# Altium schematic sheet Switch.SchDoc
size A4; DocumentNumber: 9; SheetNumber: 9; SheetTotal: 10
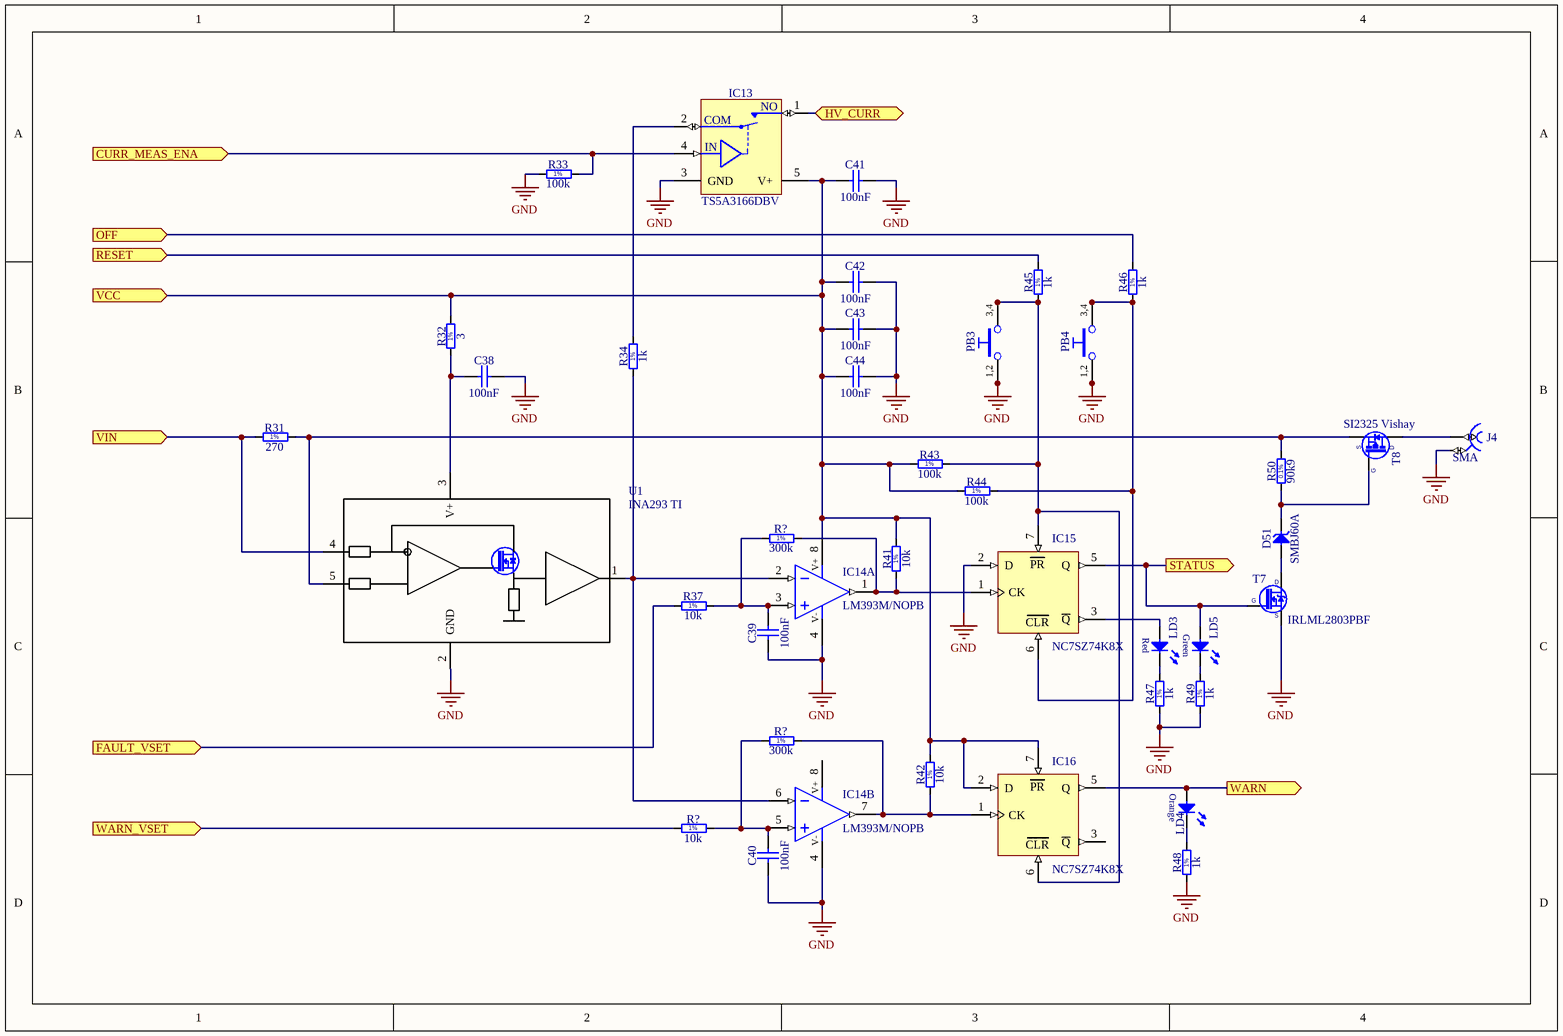
[diagram p0: Switch.SchDoc]

## Parts
(Parts that share a designator on the sheet are numbered #1, #2 ... from top to bottom, then left to right.)
C38  100nF  [CAPC2012X135N]
C39  100nF  [CAPC2012X135N]
C40  100nF  [CAPC2012X135N]
C41  100nF  [CAPC2012X135N]
C42  100nF  [CAPC2012X135N]
C43  100nF  [CAPC2012X135N]
C44  100nF  [CAPC2012X135N]
D51  SMBJ60A  [DIOM5336X265N]
IC13  TS5A3166DBV  [SOT95P280X145-5N]
IC14  LM393M/NOPB  [SOIC127P600X175-8N]  (parts A,B of 2)
IC15  NC7SZ74K8X  [SOP50P310X90-8N]
IC16  NC7SZ74K8X  [SOP50P310X90-8N]
J4  SMA  [AMPHENOL_132134]
LD3  Super Red  [LED_OSRAM_LSR976]  (value not drawn)
LD4  Orange  [LED_OSRAM_LOR976]  (value not drawn)
LD5  Green  [LED_OSRAM_LGR971]  (value not drawn)
PB3  Push Button  [PB_OMRON_B3F-1000]  (value not drawn)
PB4  Push Button  [PB_OMRON_B3F-1000]  (value not drawn)
R31  270  [RESC2012X60N]
R32  3  [RESC2012X60N]
R33  100k  [RESC2012X60N]
R34  1k  [RESC2012X60N]
R37  10k  [RESC2012X60N]
R41  10k  [RESC2012X60N]
R42  10k  [RESC2012X60N]
R43  100k  [RESC2012X60N]
R44  100k  [RESC2012X60N]
R45  1k  [RESC2012X60N]
R46  1k  [RESC2012X60N]
R47  1k  [RESC2012X60N]
R48  1k  [RESC2012X60N]
R49  1k  [RESC2012X60N]
R50  90k9  [RESC2012X60N]
R?#1  300k  [RESC2012X60N]
R?#2  300k  [RESC2012X60N]
R?#3  10k  [RESC2012X60N]
T7  IRLML2803PBF  [SOT95P237X112-3N]
T8  SI2325 Vishay  [SOT95P230X112-3N]
U1  INA293 TI  [SOT95P280X110-5N]

## Ports
CURR_MEAS_ENA (in), FAULT_VSET (in), HV_CURR (bidir), OFF (in), RESET (in), STATUS (out), VCC (in), VIN (in), WARN (out), WARN_VSET (in)

## Nets
GND: C38.2 C39.1 C40.1 C41.2 C42.2 C43.2 C44.2 IC13.3(GND) IC14.4(V-) IC15.2(D) J4.2 PB3.1 PB3.2 PB4.1 PB4.2 R33.1 R47.1 R48.1 R49.1 T7.2(S) U1.2(GND)
CURR_MEAS_ENA: IC13.4(IN) R33.2 ; port CURR_MEAS_ENA
FAULT_VSET: R37.1 ; port FAULT_VSET
HV_CURR: IC13.1(NO) ; port HV_CURR
OFF: R46.2 ; port OFF
RESET: R45.2 ; port RESET
STATUS: IC15.5(Q) LD5.2(A) T7.1(G) ; port STATUS
VCC: C41.1 C42.1 C43.1 C44.1 IC13.5(V+) IC14.1(OUT) IC14.8(V+) IC15.1(CK) IC16.2(D) IC16.7(~{PR}) R32.2 R41.1 R41.2 R42.2 R43.1 R44.1 R?#1.2 ; port VCC
VIN: R31.1 U1.4(VIN-) ; port VIN
WARN: IC16.5(Q) LD4.2(A) ; port WARN
WARN_VSET: R?#3.1 ; port WARN_VSET
NetC38_1: C38.1 R32.1 U1.3(V+)
NetC39_2: C39.2 IC14.3(IN+) R37.2 R?#1.1
NetC40_2: C40.2 IC14.5(IN+) R?#2.1 R?#3.2
NetD51_1: D51.1(C) R50.1 T8.1(G)
NetD51_2: D51.2(A) T7.3(D)
NetIC13_2: IC13.2(COM) R34.2
NetIC14_2: IC14.2(IN-) IC14.6(IN-) R34.1 U1.1(OUT)
NetIC14_7: IC14.7(OUT) IC16.1(CK) R42.1 R?#2.2
NetIC15_3: IC15.3(~{Q}) LD3.2(A)
NetIC15_6: IC15.6(~{CLR}) PB4.3 PB4.4 R44.2 R46.1
NetIC15_7: IC15.7(~{PR}) IC16.6(~{CLR}) PB3.3 PB3.4 R43.2 R45.1
NetJ4_1: J4.1 T8.4(D)
NetLD3_1: LD3.1(C) R47.2
NetLD4_1: LD4.1(C) R48.2
NetLD5_1: LD5.1(C) R49.2
NetR31_2: R31.2 R50.2 T8.3(S) U1.5(VIN+)

Not connected (* = marked no-connect by the designer): IC15 4(GND) 8(VCC); IC16 3(~{Q}) 4(GND) 8(VCC)

## Notes on the sheet
- (in symbol LED_OSRAM_LSR976) Red
- (in symbol NC7SZ74K8X) PR; CLR
- (in symbol PB_OMRON_B3F-1000) 3,4; 1,2
- (in symbol R0805_1K_1%_0.33W_100PPM_VISHAY_CRCW-HP) 1%
- (in symbol R0805_3R_1%_0.125W_200PPM) 1%
- (in symbol R0805_10K_1%_0.125W_100PPM) 1%
- (in symbol R0805_90K9_0.1%_0.1W_10PPM) 0.1%
- (in symbol R0805_100K_1%_0.125W_100PPM) 1%
- (in symbol R0805_270R_1%_0.125W_100PPM) 1%
- (in symbol R0805_300K_1%_0.125W_100PPM) 1%

## Library data of the parts
C38-C44 = CC0805_100NF_50V_10%_X7R: Non-polarised capacitor; Part Description: SMD Multilayer Chip Ceramic Capacitor; Manufacturer: GENERIC; Manufacturer1 Part Number: C2012X7R1H104K085AA; Voltage: 50V; TC: X7R; Tolerance: ±10%; Part Number: CC0805_100NF_50V_10%_X7R; Component Kind: Standard; Component Type: Standard; Pin Count: 2; Value: 100nF; Status: Preferred; Manufacturer Part Number: CC0805_100NF_50V_10%_X7R; Case: 0805; Mounted: Yes; Socket: No; SMD: Yes; Sense: No; Manufacturer1 Example: TDK; Manufacturer1 ComponentHeight: 1mm; HelpURL: \\cern.ch\dfs\Applications\Altium\Datasheets\CC0805_X7R_TDK_C.pdf; Author: CERN DEM JLC; CreateDate: 03.12.2007; LatestRevisionDate: 22.04.2015
D51 = SMBJ60A: Zener Diode; Part Description: Uni-Directional Transient Voltage Suppressor Diode; Manufacturer: FAIRCHILD SEMICONDUCTOR; Voltage: 60V; Power: 600W; PressFit: No; Bonding: No; Part Number: SMBJ60A; Component Kind: Standard; Component Type: Standard; Device: SMBJ60A; PackageDescription: DO-214-AA/SMB Diode, Molded Body; 5.34mm L X 3.625mm W X 2.65mm H, IPC Medium Density; Manufacturer Part Number: SMBJ60A; Pin Count: 2; Case: DO-214AA; Mounted: Yes; Socket: No; SMD: Yes; Sense: No; ComponentHeight: 2.65mm; HelpURL: \\cern.ch\dfs\Applications\Altium\Datasheets\SMBJ.pdf; Author: CERN DEM JLC; CreateDate: 30.06.2008; LatestRevisionDate: 19.12.2011
IC13 = TS5A3166DBV: 0.9-Ω SPST Analog Switch; Manufacturer: TEXAS INSTRUMENTS; PressFit: No; Bonding: No; Part Number: TS5A3166DBV; Component Kind: Standard; Component Type: Standard; Device: TS5A3166DBV; PackageDescription: SOT, 0.95mm pitch; 5 pin, 1.60mm W X 2.90mm L X 1.45mm H body, IPC Medium Density; Part Description: 0.9-Ω SPST Analog Switch; Manufacturer Part Number: TS5A3166DBV; Pin Count: 5; Case: SOT23-5; Mounted: Yes; Socket: No; SMD: Yes; Sense: No; ComponentHeight: 1.45mm; Author: CERN DEM MR; HelpURL: \\cern.ch\dfs\Applications\Altium\Datasheets\TS5A3166DBV.pdf; CreateDate: 16.06.2016; LatestRevisionDate: 16.06.2016
IC14 = LM393M/NOPB: Dual Operational Amplifier; Part Description: Low Power Low Offset Voltage Dual Comparators; Manufacturer: NATIONAL SEMICONDUCTOR; PressFit: No; Bonding: No; Part Number: LM393M/NOPB; Component Kind: Standard; Component Type: Standard; Device: LM393M/NOPB; PackageDescription: SOIC 8, Pitch 1.27mm - Body 4x5mm, IPC Medium Density; Manufacturer Part Number: LM393M/NOPB; Pin Count: 8; Case: SOIC8; Mounted: Yes; Socket: No; SMD: Yes; Sense: No; ComponentHeight: 1.75mm; Author: CERN DEM JLC; HelpURL: \\cern.ch\dfs\Applications\Altium\Datasheets\LM393M-NOPB.pdf; CreateDate: 18.11.2011; LatestRevisionDate: 18.11.2011
IC15 IC16 = NC7SZ74K8X: TinyLogic® UHS D-Type Flip-Flop With Preset And Clear; Manufacturer: FAIRCHILD SEMICONDUCTOR; PressFit: No; Bonding: No; Part Number: NC7SZ74K8X; Component Kind: Standard; Component Type: Standard; Device: NC7SZ74K8X; PackageDescription: SOP, 0.50mm pitch; 8 pin, 2.30mm W X 2.00mm L X 0.90mm H body, PC Medium Density; Part Description: TinyLogic® UHS D-Type Flip-Flop With Preset And Clear; Manufacturer Part Number: NC7SZ74K8X; Pin Count: 6; Case: TSSOP8; Mounted: Yes; Socket: No; SMD: Yes; Sense: No; ComponentHeight: 0.9mm; Author: CERN DEM JLC; HelpURL: \\cern.ch\dfs\Applications\Altium\Datasheets\NC7SZ74K8X.pdf; CreateDate: 31.08.2011; LatestRevisionDate: 31.08.2011
J4 = AMPHENOL_132134: Part Description: 50 Ohm Through Hole SMA Straight PCB Jack; Manufacturer Part Number: 132134; PressFit: No; Part Number: AMPHENOL_132134; Component Kind: Standard; Component Type: Standard; Pin Count: 4; Family: SMA; Mounted: Yes; Socket: No; SMD: No; Sense: No; Status: None; Manufacturer: AMPHENOL; ComponentHeight: 9.53mm; HelpURL: \\cern.ch\dfs\Applications\Altium\Datasheets\AMPHENOL_132134.pdf; Author: CERN DEM JLC; CreateDate: 16.12.2013; LatestRevisionDate: 16.12.2013
LD3 = LED_OSRAM_LSR976: LED Red 1C 2A; Part Description: Surface Mount Super Red LED (0805 Case); Manufacturer: OSRAM; Manufacturer Part Number: LSR976; PressFit: No; Bonding: No; Part Number: LED_OSRAM_LSR976; Component Kind: Standard; Component Type: Standard; Color: Super Red; PackageDescription: Super Red Chip LED, 2-Leads, Body 2 x1.25mm, IPC Medium Density; Pin Count: 2; Case: 0805; Mounted: Yes; Socket: No; SMD: Yes; Sense: No; ComponentHeight: 0.9mm; HelpURL: \\cern.ch\dfs\Applications\Altium\Datasheets\LED_OSRAM_LSR976.pdf; Author: CERN DEM JLC; CreateDate: 18.05.2010; LatestRevisionDate: 18.05.2010
LD4 = LED_OSRAM_LOR976: LED Orange 1C 2A; Part Description: Surface Mount Orange LED (0805 Case); Manufacturer: OSRAM; Manufacturer Part Number: LOR976; PressFit: No; Bonding: No; Part Number: LED_OSRAM_LOR976; Component Kind: Standard; Component Type: Standard; Color: Orange; PackageDescription: Orange Chip LED, 2-Leads, Body 2 x1.25mm, IPC Medium Density; Pin Count: 2; Case: 0805; Mounted: Yes; Socket: No; SMD: Yes; Sense: No; ComponentHeight: 0.9mm; HelpURL: \\cern.ch\dfs\Applications\Altium\Datasheets\LED_OSRAM_LOR976.pdf; Author: CERN DEM JLC; CreateDate: 18.05.2010; LatestRevisionDate: 18.05.2010
LD5 = LED_OSRAM_LGR971: LED Green 1C 2A; Part Description: Surface Mount Green LED (0805 Case); Manufacturer: OSRAM; Manufacturer Part Number: LGR971; PressFit: No; Bonding: No; Part Number: LED_OSRAM_LGR971; Component Kind: Standard; Component Type: Standard; Color: Green; PackageDescription: Green Chip LED, 2-Leads, Body 2.0x1.25mm, IPC Medium Density; Pin Count: 2; Case: 0805; Mounted: Yes; Socket: No; SMD: Yes; Sense: No; ComponentHeight: 0.9mm; HelpURL: \\cern.ch\dfs\Applications\Altium\Datasheets\LED_OSRAM_LGR971.pdf; Author: CERN DEM JLC; CreateDate: 28.01.2009; LatestRevisionDate: 17.03.2010
PB3 PB4 = PB_OMRON_B3F-1000: Push-Button Switch SPDT; Part Description: 24VDC 50mA SPST-NO Tactile Push-Button Switch (h=4.5mm); Manufacturer: OMRON; PressFit: No; Part Number: PB_OMRON_B3F-1000; Component Kind: Standard; Component Type: Standard; Pin Count: 4; PackageDescription: 6x6mm Model, Horizontal, Flat Plunger Type (without Ground Terminal) Pushbutton Switch, OMRON B3F Series; Family: Push Button; Mounted: Yes; Socket: No; SMD: No; Sense: No; Status: None; Manufacturer Part Number: B3F-1000; ComponentHeight: 4.5mm; HelpURL: \\cern.ch\dfs\Applications\Altium\Datasheets\PB_OMRON_B3F-1000.pdf; Author: CERN DEM JMW; CreateDate: 23.10.2008; LatestRevisionDate: 06.05.2009
R31 = R0805_270R_1%_0.125W_100PPM: Resistor - 1%; Part Description: General Purpose Thick Film Chip Resistor; Manufacturer: GENERIC; Manufacturer1 Part Number: NRC10F2700TRF; Power: 0.125W; TC: ±100ppm/°C; PressFit: No; Part Number: R0805_270R_1%_0.125W_100PPM; Component Kind: Standard; Component Type: Standard; Pin Count: 2; Value: 270; Status: Preferred; Tolerance: ±1%; Manufacturer Part Number: R0805_270R_1%_0.125W_100PPM; Case: 0805; Mounted: Yes; Sense: No; Socket: No; SMD: Yes; Manufacturer1 Example: NIC COMPONENT; Manufacturer1 ComponentHeight: 0.6mm; HelpURL: \\cern.ch\dfs\Applications\Altium\Datasheets\R0805_NIC_NRC.pdf; Author: CERN DEM JLC; CreateDate: 03.12.2007; LatestRevisionDate: 13.03.2008
R32 = R0805_3R_1%_0.125W_200PPM: Resistor - 1%; Part Description: General Purpose Thick Film Chip Resistor; Manufacturer: GENERIC; Manufacturer1 Part Number: 232273463008L or RC0805FR-073RL; Power: 0.125W; TC: ±200ppm/°C; PressFit: No; Part Number: R0805_3R_1%_0.125W_200PPM; Component Kind: Standard; Component Type: Standard; Pin Count: 2; Value: 3; Status: Preferred; Tolerance: ±1%; Manufacturer Part Number: R0805_3R_1%_0.125W_200PPM; Case: 0805; Mounted: Yes; Sense: No; Socket: No; SMD: Yes; Manufacturer1 Example: YAGEO PHYCOMP; Manufacturer1 ComponentHeight: 0.65mm; HelpURL: \\cern.ch\dfs\Applications\Altium\Datasheets\R0805_Phycomp_RC0805.pdf; Author: CERN DEM JLC; CreateDate: 03.12.2007; LatestRevisionDate: 17.10.2012
R33 R43 R44 = R0805_100K_1%_0.125W_100PPM: Resistor - 1%; Part Description: General Purpose Thick Film Chip Resistor; Manufacturer: GENERIC; Manufacturer1 Part Number: NRC10F1003TRF; Power: 0.125W; TC: ±100ppm/°C; PressFit: No; Part Number: R0805_100K_1%_0.125W_100PPM; Component Kind: Standard; Component Type: Standard; Pin Count: 2; Value: 100k; Status: Preferred; Tolerance: ±1%; Manufacturer Part Number: R0805_100K_1%_0.125W_100PPM; Case: 0805; Mounted: Yes; Sense: No; Socket: No; SMD: Yes; Manufacturer1 Example: NIC COMPONENT; Manufacturer1 ComponentHeight: 0.6mm; HelpURL: \\cern.ch\dfs\Applications\Altium\Datasheets\R0805_NIC_NRC.pdf; Author: CERN DEM JLC; CreateDate: 03.12.2007; LatestRevisionDate: 13.03.2008
R34 R45-R49 = R0805_1K_1%_0.33W_100PPM_VISHAY_CRCW-HP: Resistor - 1%; Part Description: 150V, Pulse Proof, High Power Thick Film Chip Resistor; Manufacturer: VISHAY DRALORIC; Manufacturer Part Number: CRCW08051K00FKEAHP; Power: 0.33W; TC: ±100ppm/°C; PressFit: No; Part Number: R0805_1K_1%_0.33W_100PPM_VISHAY_CRCW-HP; Component Kind: Standard; Component Type: Standard; Pin Count: 2; Value: 1k; Status: None; Tolerance: ±1%; Case: 0805; Mounted: Yes; Sense: No; Socket: No; SMD: Yes; Manufacturer1 ComponentHeight: 0.6mm; HelpURL: \\cern.ch\dfs\Applications\Altium\Datasheets\R0805_VISHAY_CRCW-HP e3.pdf; Author: CERN DEM JLC; CreateDate: 16.06.2010; LatestRevisionDate: 16.06.2010
R37 R41 R42 R?#3 = R0805_10K_1%_0.125W_100PPM: Resistor - 1%; Part Description: General Purpose Thick Film Chip Resistor; Manufacturer: GENERIC; Manufacturer1 Part Number: NRC10F1002TRF; Power: 0.125W; TC: ±100ppm/°C; PressFit: No; Part Number: R0805_10K_1%_0.125W_100PPM; Component Kind: Standard; Component Type: Standard; Pin Count: 2; Value: 10k; Status: Preferred; Tolerance: ±1%; Manufacturer Part Number: R0805_10K_1%_0.125W_100PPM; Case: 0805; Mounted: Yes; Sense: No; Socket: No; SMD: Yes; Manufacturer1 Example: NIC COMPONENT; Manufacturer1 ComponentHeight: 0.6mm; HelpURL: \\cern.ch\dfs\Applications\Altium\Datasheets\R0805_NIC_NRC.pdf; Author: CERN DEM JLC; CreateDate: 03.12.2007; LatestRevisionDate: 13.03.2008
R50 = R0805_90K9_0.1%_0.1W_10PPM: Resistor - 0.1%; Part Description: Thin Film Chip Resistor; Manufacturer: GENERIC; Manufacturer1 Part Number: RN73C2A90K9BTG; Power: 0.1W; TC: ±10ppm; PressFit: No; Part Number: R0805_90K9_0.1%_0.1W_10PPM; Component Kind: Standard; Component Type: Standard; Pin Count: 2; Value: 90k9; Status: Not Recommended; Tolerance: ±0.1%; Manufacturer Part Number: R0805_90K9_0.1%_0.1W_10PPM; Case: 0805; Mounted: Yes; Sense: No; Socket: No; SMD: Yes; Manufacturer1 Example: TYCO HOLSWORTHY; Manufacturer1 ComponentHeight: 0.6mm; HelpURL: \\cern.ch\dfs\Applications\Altium\Datasheets\R0805_Tyco_RN73.pdf; Author: CERN DEM JLC; CreateDate: 03.12.2007; LatestRevisionDate: 13.03.2008
R?#1 R?#2 = R0805_300K_1%_0.125W_100PPM: Resistor - 1%; Part Description: General Purpose Thick Film Chip Resistor; Manufacturer: GENERIC; Manufacturer1 Part Number: NRC10F3003TRF; Power: 0.125W; TC: ±100ppm/°C; PressFit: No; Part Number: R0805_300K_1%_0.125W_100PPM; Component Kind: Standard; Component Type: Standard; Pin Count: 2; Value: 300k; Status: Preferred; Tolerance: ±1%; Manufacturer Part Number: R0805_300K_1%_0.125W_100PPM; Case: 0805; Mounted: Yes; Sense: No; Socket: No; SMD: Yes; Manufacturer1 Example: NIC COMPONENT; Manufacturer1 ComponentHeight: 0.6mm; HelpURL: \\cern.ch\dfs\Applications\Altium\Datasheets\R0805_NIC_NRC.pdf; Author: CERN DEM JLC; CreateDate: 03.12.2007; LatestRevisionDate: 13.03.2008
T7 = IRLML2803PBF: N-CHANNEL MOSFET WITH ZENER DIODE; Part Description: 30V 1.2A  N-Channel HEXFET® Power MOSFET; Manufacturer: INTERNATIONAL RECTIFIER; PressFit: No; Bonding: No; Part Number: IRLML2803PBF; Component Kind: Standard; Component Type: Standard; Device: IRLML2803PBF; PackageDescription: SOT, 0.95mm, pitch; 3 pin,1.30mm W X 2.92mm L X 1.12mm H body, IPC Medium Density; Manufacturer Part Number: IRLML2803PBF; Pin Count: 3; Case: SOT23-3; Mounted: Yes; Socket: No; SMD: Yes; Sense: No; ComponentHeight: 1.12mm; HelpURL: \\cern.ch\dfs\Applications\Altium\Datasheets\IRLML2803PBF.pdf; Author: CERN DEM JMW; CreateDate: 08.12.2010; LatestRevisionDate: 08.12.2010
T8 = SI2325: P-Channel MOSFET; Name: SI2325; Manufacturer: Vishay
U1 = INA293: Name: INA293; Manufacturer: TI